# Altium schematic sheet ESP32_Remote_Control.SchDoc
size A4
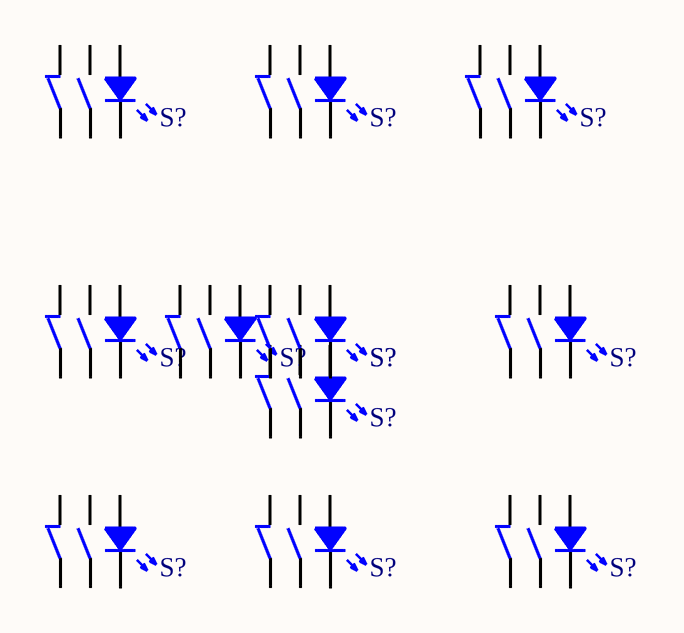
[diagram p0: ESP32_Remote_Control.SchDoc]

## Parts
(Parts that share a designator on the sheet are numbered #1, #2 ... from top to bottom, then left to right.)
S?#1  MP86A0BUH-G  [MP86A0BUH-G]  (value not drawn)
S?#2  MP86A0BUH-G  [MP86A0BUH-G]  (value not drawn)
S?#3  MP86A0BUH-G  [MP86A0BUH-G]  (value not drawn)
S?#4  MP86A0BUH-G  [MP86A0BUH-G]  (value not drawn)
S?#5  MP86A0BUH-G  [MP86A0BUH-G]  (value not drawn)
S?#6  MP86A0BUH-G  [MP86A0BUH-G]  (value not drawn)
S?#7  MP86A0BUH-G  [MP86A0BUH-G]  (value not drawn)
S?#8  MP86A0BUH-G  [MP86A0BUH-G]  (value not drawn)
S?#9  MP86A0BUH-G  [MP86A0BUH-G]  (value not drawn)
S?#10  MP86A0BUH-G  [MP86A0BUH-G]  (value not drawn)
S?#11  MP86A0BUH-G  [MP86A0BUH-G]  (value not drawn)
S?#12  MP86A0BUH-G  [MP86A0BUH-G]  (value not drawn)

## Nets
NetS?#6_1: S?#6.1 S?#7.1
NetS?#6_1: S?#6.1 S?#7.1  [a separate net that carries the same name]
NetS?#6_2: S?#6.2 S?#7.2
NetS?#6_3: S?#6.3 S?#7.3
NetS?#6_B: S?#6.B(A) S?#7.B(A)
NetS?#6_C: S?#6.C(K) S?#7.C(K)

Not connected (* = marked no-connect by the designer): S?#1 1 2 3 B(A) C(K); S?#2 1 2 3 B(A) C(K); S?#3 1 2 3 B(A) C(K); S?#4 1 2 3 B(A) C(K); S?#5 1 2 3 B(A) C(K); S?#8 1 2 3 B(A) C(K); S?#9 1 2 3 B(A) C(K); S?#10 1 2 3 B(A) C(K); S?#11 1 2 3 B(A) C(K); S?#12 1 2 3 B(A) C(K)

## Library data of the parts
S?#1-S?#12 = MP86A0BUH-G: Button mit LED